# Altium schematic sheet ph Sense.SchDoc
size A
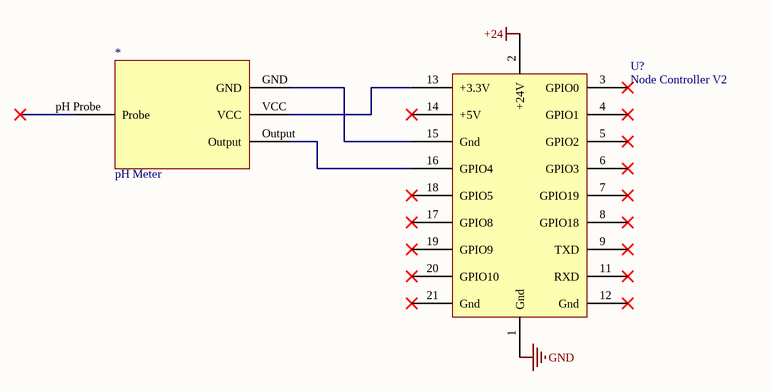
[diagram p0: ph Sense.SchDoc]

## Parts
*  pH Meter
U?  Node Controller V2

## Nets
+24: U?.2(+24V)
GND: U?.1(Gnd)
Net*_GND: *.GND U?.15(Gnd)
Net*_Output: *.Output U?.16(GPIO4)
Net*_VCC: *.VCC U?.13(+3.3V)

Not connected (* = marked no-connect by the designer): * pH Probe(Probe)*; U? 3(GPIO0)* 4(GPIO1)* 5(GPIO2)* 6(GPIO3)* 7(GPIO19)* 8(GPIO18)* 9(TXD)* 11(RXD)* 12(Gnd)* 14(+5V)* 17(GPIO8)* 18(GPIO5)* 19(GPIO9)* 20(GPIO10)* 21(Gnd)*